# Altium project roneCPUBoard-v8.PrjPCB
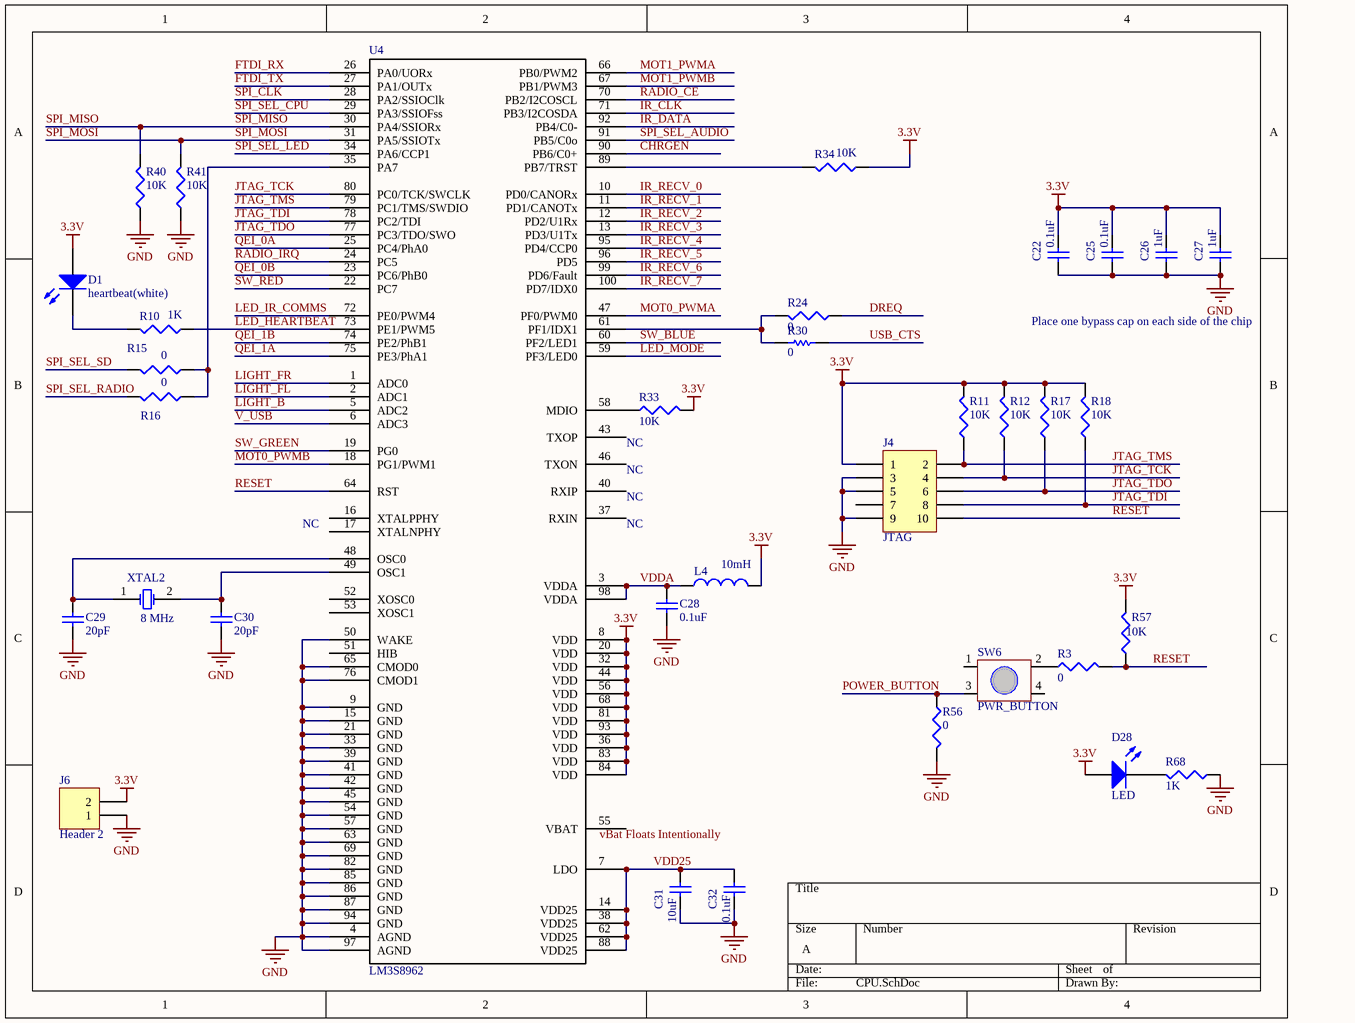
[diagram p0: CPU.SchDoc]
7 sheets, 146 parts. Net scope: global (net labels, ports and power ports of the same name join across sheets).
Board file: roneCPUBoard-v8.PcbDoc
Sheets:
  CPU.SchDoc
  USB_Headers.SchDoc
  LightSensorsButtons.SchDoc
  IRComms.SchDoc
  Radio.SchDoc
  LEDs.SchDoc
  SoundChip-ProtoHeader.SchDoc

## Sheet CPU.SchDoc
size A; PageSetup: Record=PageOptions|CenterHorizontal=True|CenterVertical=True|PrintScale=1.05|XCorrection=1.00|YCorrection=1.00|PrintKind=1|BorderSize=5000000|LeftOffset=0|BottomOffset=0|Orientation=2|PaperLength=1000|PaperWidth=1000|Scale=100|PaperSource=262|PrintQuality=600|MediaType=1|DitherType=10|PaperKind=Letter|PrintScaleMode=1

### Parts
C22  value 0.1uF  [CAPC1005L]  (hidden comment: Cap Semi)
C25  value 0.1uF  [CAPC1005L]  (hidden comment: Cap Semi)
C26  value 1uF  [CAPC1608L]  (hidden comment: Cap Semi)
C27  value 1uF  [CAPC1608L]  (hidden comment: Cap Semi)
C28  value 0.1uF  [CAPC1005L]  (hidden comment: Cap Semi)
C29  value 20pF  [CAPC1005L]  (hidden comment: Cap Semi)
C30  value 20pF  [CAPC1005L]  (hidden comment: Cap Semi)
C31  value 10uF  [CAPC1608L]  (hidden comment: Cap Semi)
C32  value 0.1uF  [CAPC1005L]  (hidden comment: Cap Semi)
D1  heartbeat(white)  [INDC2012L]
D28  LED  [SurfaceMount(603)]
J4  JTAG  [JTAG-10]
J6  Header 2  [HDR1X2]
L4  value 10mH  [INDC2012L]  (hidden comment: Inductor)
R3  value 0  [RESC1608L]  (hidden comment: Res3)
R10  value 1K  [RESC1608L]  (hidden comment: Res3)
R11  value 10K  [RESC1608L]  (hidden comment: Res3)
R12  value 10K  [RESC1608L]  (hidden comment: Res3)
R15  value 0  [RESC1608L]  (hidden comment: Res3)
R16  value 0  [RESC1608L]  (hidden comment: Res3)
R17  value 10K  [RESC1608L]  (hidden comment: Res3)
R18  value 10K  [RESC1608L]  (hidden comment: Res3)
R24  value 0  [RESC1608L]  (hidden comment: Res3)
R30  value 0  [RESC1608L]
R33  value 10K  [RESC1608L]  (hidden comment: Res3)
R34  value 10K  [RESC1608L]  (hidden comment: Res3)
R40  value 10K  [RESC1608L]  (hidden comment: Res3)
R41  value 10K  [RESC1608L]  (hidden comment: Res3)
R56  value 0  [RESC1608L]  (hidden comment: Res3)
R57  value 10K  [RESC1608L]  (hidden comment: Res3)
R68  value 1K  [RESC1608L]  (hidden comment: Res3)
SW6  PWR_BUTTON  [SwitchTall-TL330]
U4  LM3S8962  [LQFP-100]
XTAL2  8 MHz  [RESC5025L]

### Nets
3.3V: C22.2 C25.2 C26.2 C27.2 D1.1(A) D28.1(A) J4.1 J6.2 L4.2 R11.2 R12.2 R17.2 R18.2 R33.2 R34.1 R57.2 U4.8(VDD) U4.20(VDD) U4.32(VDD) U4.36(VDD) U4.44(VDD) U4.56(VDD) U4.68(VDD) U4.81(VDD) U4.83(VDD) U4.84(VDD) U4.93(VDD)
GND: C22.1 C25.1 C26.1 C27.1 C28.1 C29.1 C30.1 C31.1 C32.1 J4.3 J4.5 J4.9 J6.1 R40.1 R41.1 R56.2 R68.1 U4.4(AGND) U4.9(GND) U4.15(GND) U4.21(GND) U4.33(GND) U4.39(GND) U4.41(GND) U4.42(GND) U4.45(GND) U4.50(WAKE) U4.54(GND) U4.57(GND) U4.63(GND) U4.65(CMOD0) U4.69(GND) U4.76(CMOD1) U4.82(GND) U4.85(GND) U4.86(GND) U4.87(GND) U4.94(GND) U4.97(AGND)
V_USB: U4.6(ADC3)
CHRGEN: U4.90(PB6/C0+)
DREQ: R24.2
FTDI_RX: U4.26(PA0/UORx)
FTDI_TX: U4.27(PA1/OUTx)
IR_CLK: U4.71(PB3/I2COSDA)
IR_DATA: U4.92(PB4/C0-)
IR_RECV_0: U4.10(PD0/CANORx)
IR_RECV_1: U4.11(PD1/CANOTx)
IR_RECV_2: U4.12(PD2/U1Rx)
IR_RECV_3: U4.13(PD3/U1Tx)
IR_RECV_4: U4.95(PD4/CCP0)
IR_RECV_5: U4.96(PD5)
IR_RECV_6: U4.99(PD6/Fault)
IR_RECV_7: U4.100(PD7/IDX0)
JTAG_TCK: J4.4 R12.1 U4.80(PC0/TCK/SWCLK)
JTAG_TDI: J4.8 R18.1 U4.78(PC2/TDI)
JTAG_TDO: J4.6 R17.1 U4.77(PC3/TDO/SWO)
JTAG_TMS: J4.2 R11.1 U4.79(PC1/TMS/SWDIO)
LED_HEARTBEAT: R10.1 U4.73(PE1/PWM5)
LED_IR_COMMS: U4.72(PE0/PWM4)
LED_MODE: U4.59(PF3/LED0)
LIGHT_B: U4.5(ADC2)
LIGHT_FL: U4.2(ADC1)
LIGHT_FR: U4.1(ADC0)
MOT0_PWMA: U4.47(PF0/PWM0)
MOT0_PWMB: U4.18(PG1/PWM1)
MOT1_PWMA: U4.66(PB0/PWM2)
MOT1_PWMB: U4.67(PB1/PWM3)
POWER_BUTTON: R56.1 SW6.3
QEI_0A: U4.25(PC4/PhA0)
QEI_0B: U4.23(PC6/PhB0)
QEI_1A: U4.75(PE3/PhA1)
QEI_1B: U4.74(PE2/PhB1)
RADIO_CE: U4.70(PB2/I2COSCL)
RADIO_IRQ: U4.24(PC5)
RESET: J4.10 R3.2 R57.1 U4.64(RST)
SPI_CLK: U4.28(PA2/SSIOClk)
SPI_MISO: R40.2 U4.30(PA4/SSIORx)
SPI_MOSI: R41.2 U4.31(PA5/SSIOTx)
SPI_SEL_AUDIO: U4.91(PB5/C0o)
SPI_SEL_CPU: U4.29(PA3/SSIOFss)
SPI_SEL_LED: U4.34(PA6/CCP1)
SPI_SEL_RADIO: R16.2
SPI_SEL_SD: R15.2
SW_BLUE: U4.60(PF2/LED1)
SW_GREEN: U4.19(PG0)
SW_RED: U4.22(PC7)
USB_CTS: R30.2
VDD25: C31.2 C32.2 U4.7(LDO) U4.14(VDD25) U4.38(VDD25) U4.62(VDD25) U4.88(VDD25)
VDDA: C28.2 L4.1 U4.3(VDDA) U4.98(VDDA)
NetC29_2: C29.2 U4.48(OSC0) XTAL2.1(OSC1)
NetC30_2: C30.2 U4.49(OSC1) XTAL2.2(OSC2)
NetD1_2: D1.2(K) R10.2
NetD28_2: D28.2(K) R68.2
NetR3_1: R3.1 SW6.2
NetR15_1: R15.1 R16.1 U4.35(PA7)
NetR24_1: R24.1 R30.1 U4.61(PF1/IDX1)
NetR33_1: R33.1 U4.58(MDIO)
NetR34_2: R34.2 U4.89(PB7/TRST)

Not connected (* = marked no-connect by the designer): J4 7; SW6 1 4; U4 16(XTALPPHY) 17(XTALNPHY) 37(RXIN) 40(RXIP) 43(TXOP) 46(TXON) 51(HIB) 52(XOSC0) 53(XOSC1) 55(VBAT)

### Notes on the sheet
- Place one bypass cap on each side of the chip
- NC
- (near U4) NC
- (near U4) vBat Floats Intentionally

### Library data of the parts
C22 C25-C32 = Cap Semi: Capacitor (Semiconductor SIM Model); Published: 8-Jun-2000; LatestRevisionDate: 29-May-2009; LatestRevisionNote: IPC-7351 Footprint Added.; PackageReference: C1206; Publisher: Altium Limited; PackageDescription: Chip Capacitor
D1 = LED2: Typical RED, GREEN, YELLOW, AMBER GaAs LED; Published: 8-Jun-2000; LatestRevisionDate: 17-Jul-2002; LatestRevisionNote: Re-released for DXP Platform.; PackageVersion: Feb-2002; PackageReference: 3.2X1.6X1.1; Publisher: Altium Limited
J4 = Header 5X2H: Header, 5-Pin, Dual row, Right Angle; LatestRevisionDate: 17-Jul-2002; LatestRevisionNote: Re-released for DXP Platform.; Publisher: Altium Limited
J6 = Header 2: Header, 2-Pin; LatestRevisionDate: 17-Jul-2002; LatestRevisionNote: Re-released for DXP Platform.; Publisher: Altium Limited
L4 = Inductor: Code_IEC: 1005; Published: 8-Jun-2000; LatestRevisionDate: 29-May-2009; LatestRevisionNote: IPC-7351 Footprint Added.; PackageReference: 0402-A; Publisher: Altium Limited; PackageDescription: Chip Inductor; Code_JEITA: 0402
R3 R10-R12 R15-R18 R24 R33 R34 R40 R41 R56 R57 R68 = Res3: Resistor; Published: 8-Jun-2000; LatestRevisionDate: 29-May-2009; LatestRevisionNote: IPC-7351 Footprint Added.; PackageReference: J1-0603; Publisher: Altium Limited; PackageDescription: Chip Resistor
R30 = Res1: Resistor; Published: 8-Jun-2000; LatestRevisionDate: 17-Jul-2002; LatestRevisionNote: Re-released for DXP Platform.; PackageReference: AXIAL-0.3; Publisher: Altium Limited
SW6 = Switch-TL330
XTAL2 = XTAL: Crystal Oscillator; Published: 8-Jun-2000; LatestRevisionDate: 17-Jul-2002; LatestRevisionNote: Re-released for DXP Platform.; PackageReference: R38; Publisher: Altium Limited

## Sheet USB_Headers.SchDoc
size A
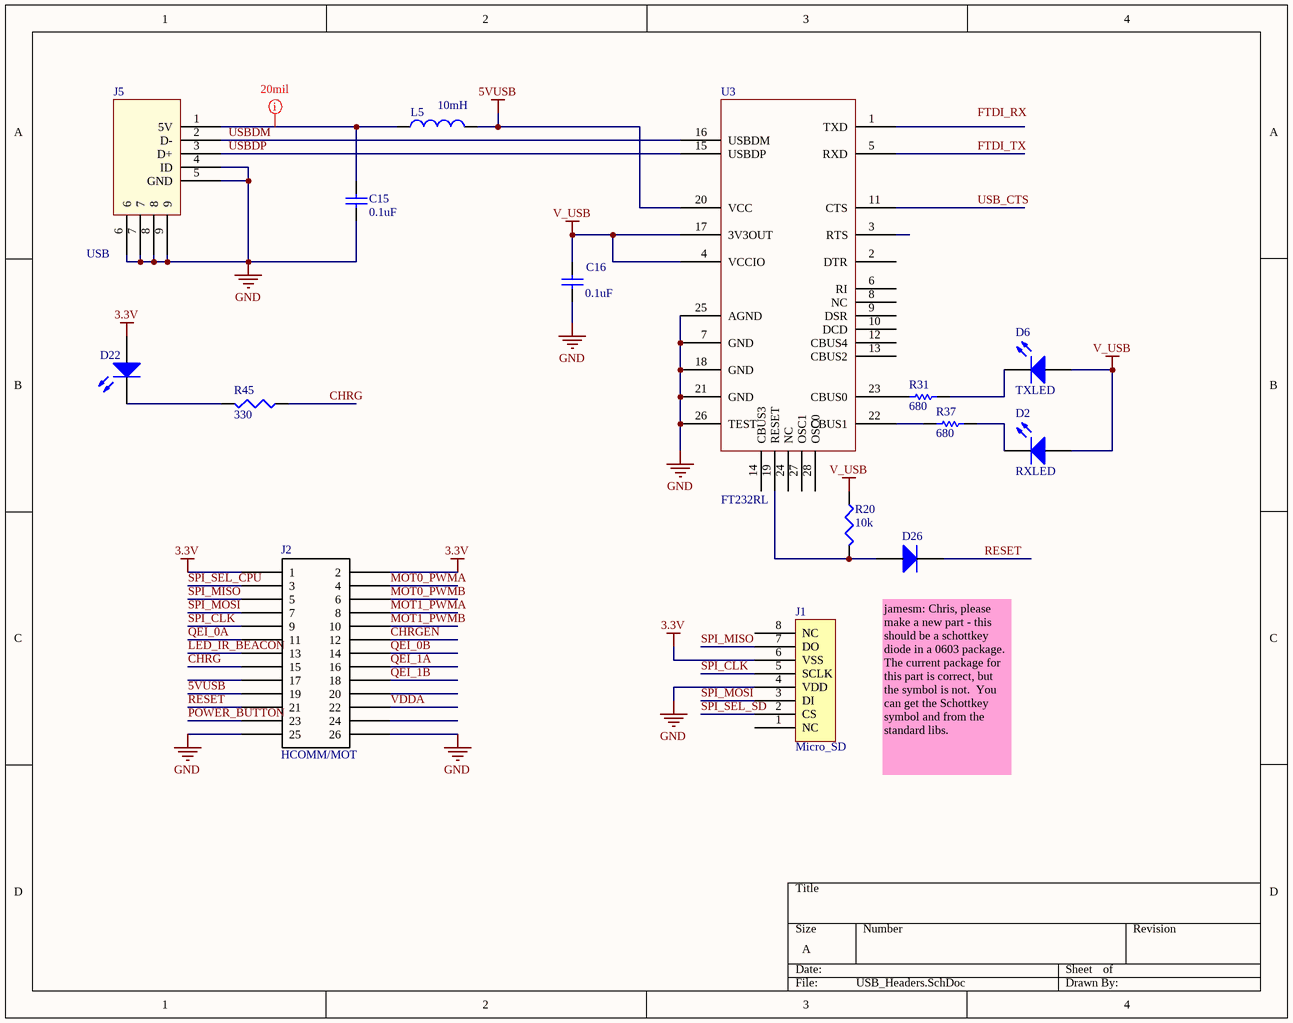
[diagram p1: USB_Headers.SchDoc]

### Parts
C15  value 0.1uF  [CAPC1005L]
C16  value 0.1uF  [CAPC1005L]
D2  RXLED  [INDC2012L]
D6  TXLED  [INDC2012L]
D22  Charge  [INDC2012L]  (value not drawn)
D26  DIODE  [SurfaceMount(603)]  (value not drawn)
J1  Micro_SD  [MICRO_SD]
J2  HCOMM/MOT  [HeaderSM 13x2]
J5  USB  [USB Minib (thru-hole)]
L5  value 10mH  [INDC2012L]  (hidden comment: Inductor)
R20  value 10k  [RESC1608L]  (hidden comment: Res3)
R31  value 680  [RESC1608L]
R37  value 680  [RESC1608L]
R45  value 330  [RESC1608L]  (hidden comment: Res3)
U3  FT232RL  [SSOP-28]

### Nets
3.3V: D22.1(A) J1.6(VSS) J2.1 J2.2
5VUSB: J2.19 L5.2 U3.20(VCC)
GND: C15.1 C16.1 J1.4(VDD) J2.25 J2.26 J5.4(ID) J5.5(GND) J5.6 J5.7 J5.8 J5.9 U3.7(GND) U3.18(GND) U3.21(GND) U3.25(AGND) U3.26(TEST)
V_USB: C16.2 D2.1(A) D6.1(A) R20.1 U3.4(VCCIO) U3.17(3V3OUT)
CHRG: J2.15 R45.1
CHRGEN: J2.12
FTDI_TX: U3.5(RXD)
LED_IR_BEACON: J2.13
MOT0_PWMA: J2.4
MOT0_PWMB: J2.6
MOT1_PWMA: J2.8
MOT1_PWMB: J2.10
POWER_BUTTON: J2.23
QEI_0A: J2.11
QEI_0B: J2.14
QEI_1A: J2.16
QEI_1B: J2.18
RESET: D26.2(K) J2.21
SPI_CLK: J1.5(SCLK) J2.9
SPI_MISO: J1.7(DO) J2.5
SPI_MOSI: J1.3(DI) J2.7
SPI_SEL_CPU: J2.3
SPI_SEL_SD: J1.2(CS)
USB_CTS: U3.11(CTS)
USBDM: J5.2(D-) U3.16(USBDM)
USBDP: J5.3(D+) U3.15(USBDP)
VDDA: J2.22
NetC15_2: C15.2 J5.1(5V) L5.1
NetD2_2: D2.2(K) R37.2
NetD6_2: D6.2(K) R31.2
NetD22_2: D22.2(K) R45.2
NetD26_1: D26.1(A) R20.2 U3.19(RESET)
NetR31_1: R31.1 U3.23(CBUS0)
NetR37_1: R37.1 U3.22(CBUS1)

Not connected (* = marked no-connect by the designer): J1 1(NC) 8(NC); J2 17 20 24; U3 1(TXD) 2(DTR) 3(RTS) 6(RI) 8(NC) 9(DSR) 10(DCD) 12(CBUS4) 13(CBUS2) 14(CBUS3) 24(NC) 27(OSC1) 28(OSC0)

### Layout directives
rule Width Constraint [Pref Width = 10mil    Min Width = 10mil    Max Width = 20mil]: NetC15_2

### Notes on the sheet
- jamesm: Chris, please make a new part - this should be a schottkey diode in a 0603 package.  The current package for this part is correct, but the symbol is not.  You can get the Schottkey symbol and from the standard libs.
- Labels drawn without touching a wire or pin: FTDI_RX

### Library data of the parts
C15 C16 = Cap: Capacitor; Published: 8-Jun-2000; LatestRevisionDate: 17-Jul-2002; LatestRevisionNote: Re-released for DXP Platform.; PackageReference: RAD-0.3; Publisher: Altium Limited
D2 D6 D22 = LED2: as D1 on sheet CPU; Published: 8-Jun-2000; LatestRevisionDate: 17-Jul-2002; LatestRevisionNote: Re-released for DXP Platform.; PackageVersion: Feb-2002; PackageReference: 3.2X1.6X1.1; Publisher: Altium Limited
J2 = HCOMM/HMOT: Header, 2X20, 50mil, IDC
J5 = USB-ConnTH
L5 = Inductor: Code_IEC: 1005; Published: 8-Jun-2000; LatestRevisionDate: 29-May-2009; LatestRevisionNote: IPC-7351 Footprint Added.; PackageReference: 0402-A; Publisher: Altium Limited; PackageDescription: Chip Inductor; Code_JEITA: 0402
R20 R45 = Res3: Resistor; Published: 8-Jun-2000; LatestRevisionDate: 29-May-2009; LatestRevisionNote: IPC-7351 Footprint Added.; PackageReference: J1-0603; Publisher: Altium Limited; PackageDescription: Chip Resistor
R31 R37 = Res1: Resistor; Published: 8-Jun-2000; LatestRevisionDate: 17-Jul-2002; LatestRevisionNote: Re-released for DXP Platform.; PackageReference: AXIAL-0.3; Publisher: Altium Limited

## Sheet LightSensorsButtons.SchDoc
size A
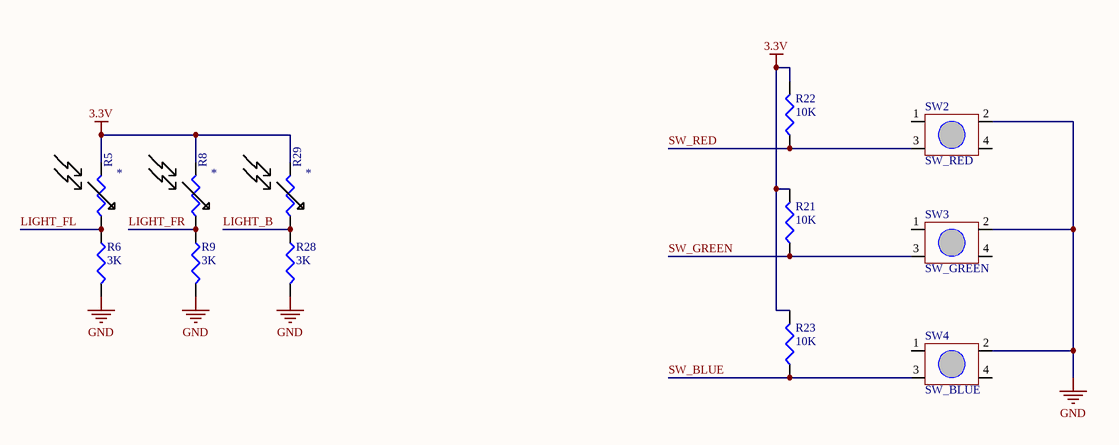
[diagram p2: LightSensorsButtons.SchDoc]

### Parts
R5  photoresistor  [photoresistor]  (value not drawn)
R6  value 3K  [RESC1608L]  (hidden comment: Res3)
R8  photoresistor  [photoresistor]  (value not drawn)
R9  value 3K  [RESC1608L]  (hidden comment: Res3)
R21  value 10K  [RESC1608L]  (hidden comment: Res3)
R22  value 10K  [RESC1608L]  (hidden comment: Res3)
R23  value 10K  [RESC1608L]  (hidden comment: Res3)
R28  value 3K  [RESC1608L]  (hidden comment: Res3)
R29  photoresistor  [photoresistor]  (value not drawn)
SW2  SW_RED  [SwitchTall-TL330]
SW3  SW_GREEN  [SwitchTall-TL330]
SW4  SW_BLUE  [SwitchTall-TL330]

### Nets
3.3V: R5.2 R8.2 R21.2 R22.2 R23.2 R29.2
GND: R6.2 R9.2 R28.2 SW2.2 SW3.2 SW4.2
LIGHT_B: R28.1 R29.1
LIGHT_FL: R5.1 R6.1
LIGHT_FR: R8.1 R9.1
SW_BLUE: R23.1 SW4.3
SW_GREEN: R21.1 SW3.3
SW_RED: R22.1 SW2.3

Not connected (* = marked no-connect by the designer): SW2 1 4; SW3 1 4; SW4 1 4

### Library data of the parts
R6 R9 R21-R23 R28 = Res3: Resistor; Published: 8-Jun-2000; LatestRevisionDate: 29-May-2009; LatestRevisionNote: IPC-7351 Footprint Added.; PackageReference: J1-0603; Publisher: Altium Limited; PackageDescription: Chip Resistor
SW2-SW4 = Switch-TL330
R5 R8 R29 = photoresistor: Value: *

## Sheet IRComms.SchDoc
size A
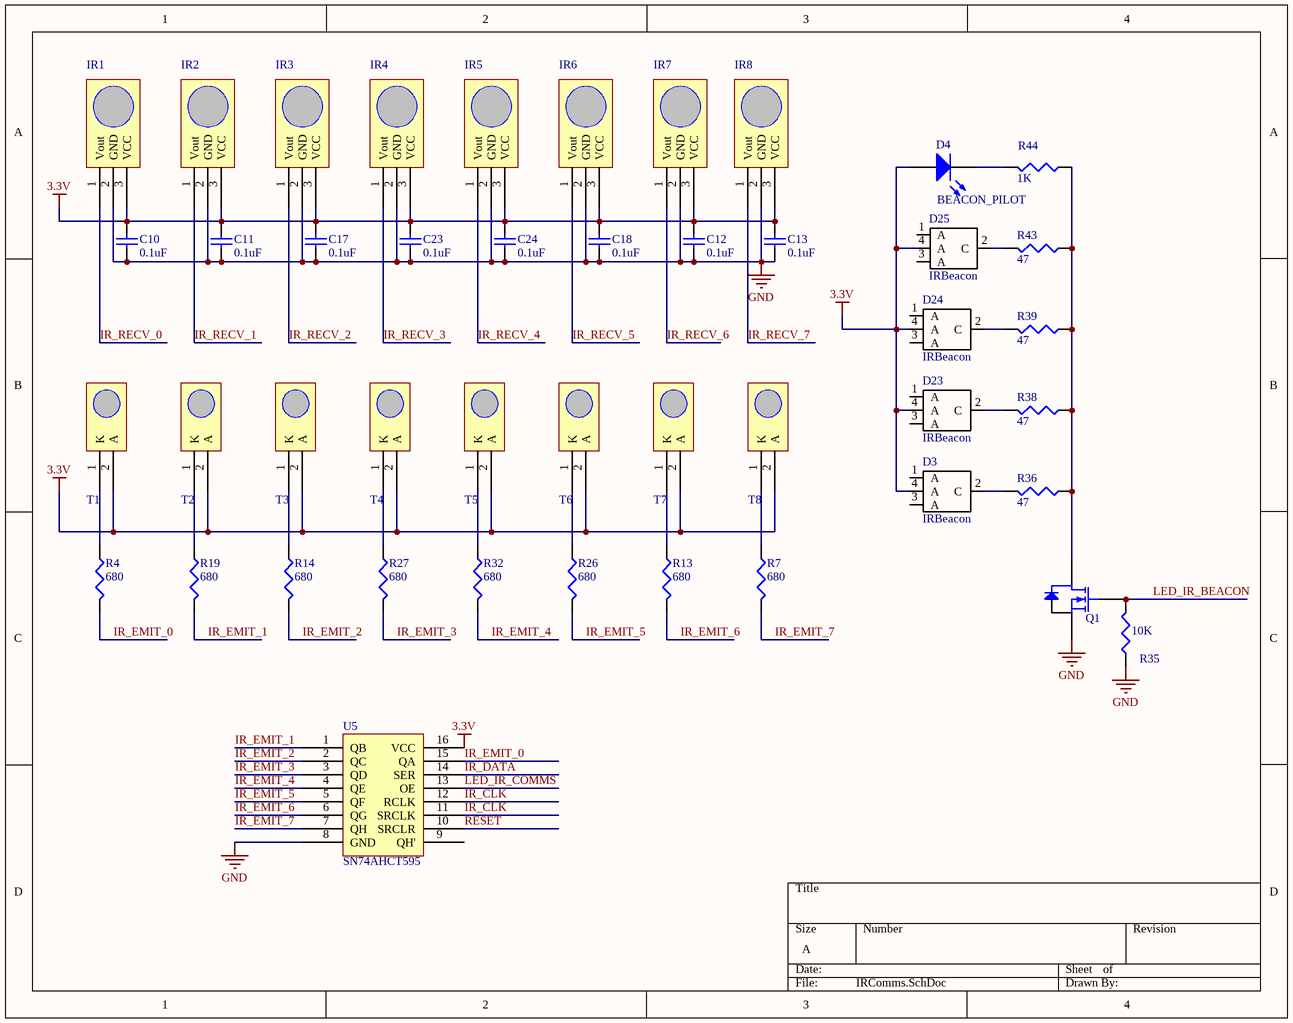
[diagram p3: IRComms.SchDoc]

### Parts
C10  value 0.1uF  [CAPC1005L]  (hidden comment: Cap Semi)
C11  value 0.1uF  [CAPC1005L]  (hidden comment: Cap Semi)
C12  value 0.1uF  [CAPC1005L]  (hidden comment: Cap Semi)
C13  value 0.1uF  [CAPC1005L]  (hidden comment: Cap Semi)
C17  value 0.1uF  [CAPC1005L]  (hidden comment: Cap Semi)
C18  value 0.1uF  [CAPC1005L]  (hidden comment: Cap Semi)
C23  value 0.1uF  [CAPC1005L]  (hidden comment: Cap Semi)
C24  value 0.1uF  [CAPC1005L]  (hidden comment: Cap Semi)
D3  IRBeacon  [IRBeacon]
D4  BEACON_PILOT  [SurfaceMount(603)]
D23  IRBeacon  [IRBeacon]
D24  IRBeacon  [IRBeacon]
D25  IRBeacon  [IRBeacon]
IR1  GP1UX31QS  [GP1UX31QS]  (value not drawn)
IR2  GP1UX31QS  [GP1UX31QS]  (value not drawn)
IR3  GP1UX31QS  [GP1UX31QS]  (value not drawn)
IR4  GP1UX31QS  [GP1UX31QS]  (value not drawn)
IR5  GP1UX31QS  [GP1UX31QS]  (value not drawn)
IR6  GP1UX31QS  [GP1UX31QS]  (value not drawn)
IR7  GP1UX31QS  [GP1UX31QS]  (value not drawn)
IR8  GP1UX31QS  [GP1UX31QS]  (value not drawn)
Q1  Mosfet  [SOT-23]  (value not drawn)
R4  value 680  [RESC1608L]  (hidden comment: Res3)
R7  value 680  [RESC1608L]  (hidden comment: Res3)
R13  value 680  [RESC1608L]  (hidden comment: Res3)
R14  value 680  [RESC1608L]  (hidden comment: Res3)
R19  value 680  [RESC1608L]  (hidden comment: Res3)
R26  value 680  [RESC1608L]  (hidden comment: Res3)
R27  value 680  [RESC1608L]  (hidden comment: Res3)
R32  value 680  [RESC1608L]  (hidden comment: Res3)
R35  value 10K  [RESC1608L]  (hidden comment: Res3)
R36  value 47  [RESC1608L]  (hidden comment: Res3)
R38  value 47  [RESC1608L]  (hidden comment: Res3)
R39  value 47  [RESC1608L]  (hidden comment: Res3)
R43  value 47  [RESC1608L]  (hidden comment: Res3)
R44  value 1K  [RESC1608L]  (hidden comment: Res3)
T1  LN54  [LN54]  (value not drawn)
T2  LN54  [LN54]  (value not drawn)
T3  LN54  [LN54]  (value not drawn)
T4  LN54  [LN54]  (value not drawn)
T5  LN54  [LN54]  (value not drawn)
T6  LN54  [LN54]  (value not drawn)
T7  LN54  [LN54]  (value not drawn)
T8  LN54  [LN54]  (value not drawn)
U5  SN74AHCT595  [TSOP65P640X120-16N]

### Nets
3.3V: C10.2 C11.2 C12.2 C13.2 C17.2 C18.2 C23.2 C24.2 D3.4(A) D4.1(A) D23.4(A) D24.4(A) D25.4(A) IR1.3(VCC) IR2.3(VCC) IR3.3(VCC) IR4.3(VCC) IR5.3(VCC) IR6.3(VCC) IR7.3(VCC) IR8.3(VCC) T1.2(A) T2.2(A) T3.2(A) T4.2(A) T5.2(A) T6.2(A) T7.2(A) T8.2(A) U5.16(VCC)
GND: C10.1 C11.1 C12.1 C13.1 C17.1 C18.1 C23.1 C24.1 IR1.2(GND) IR2.2(GND) IR3.2(GND) IR4.2(GND) IR5.2(GND) IR6.2(GND) IR7.2(GND) IR8.2(GND) Q1.2(S) R35.1 U5.8(GND)
IR_CLK: U5.11(SRCLK) U5.12(RCLK)
IR_DATA: U5.14(SER)
IR_EMIT_0: R4.2 U5.15(QA)
IR_EMIT_1: R19.2 U5.1(QB)
IR_EMIT_2: R14.2 U5.2(QC)
IR_EMIT_3: R27.2 U5.3(QD)
IR_EMIT_4: R32.2 U5.4(QE)
IR_EMIT_5: R26.2 U5.5(QF)
IR_EMIT_6: R13.2 U5.6(QG)
IR_EMIT_7: R7.2 U5.7(QH)
IR_RECV_0: IR1.1(Vout)
IR_RECV_1: IR2.1(Vout)
IR_RECV_2: IR3.1(Vout)
IR_RECV_3: IR4.1(Vout)
IR_RECV_4: IR5.1(Vout)
IR_RECV_5: IR6.1(Vout)
IR_RECV_6: IR7.1(Vout)
IR_RECV_7: IR8.1(Vout)
LED_IR_BEACON: Q1.1(G) R35.2
LED_IR_COMMS: U5.13(OE)
RESET: U5.10(SRCLR)
NetD3_2: D3.2(C) R36.2
NetD4_2: D4.2(K) R44.2
NetD23_2: D23.2(C) R38.2
NetD24_2: D24.2(C) R39.2
NetD25_2: D25.2(C) R43.2
NetQ1_3: Q1.3(D) R36.1 R38.1 R39.1 R43.1 R44.1
NetR4_1: R4.1 T1.1(K)
NetR7_1: R7.1 T8.1(K)
NetR13_1: R13.1 T7.1(K)
NetR14_1: R14.1 T3.1(K)
NetR19_1: R19.1 T2.1(K)
NetR26_1: R26.1 T6.1(K)
NetR27_1: R27.1 T4.1(K)
NetR32_1: R32.1 T5.1(K)

Not connected (* = marked no-connect by the designer): D3 1(A) 3(A); D23 1(A) 3(A); D24 1(A) 3(A); D25 1(A) 3(A); U5 9(QH')

### Library data of the parts
C10-C13 C17 C18 C23 C24 = Cap Semi: Capacitor (Semiconductor SIM Model); Published: 8-Jun-2000; LatestRevisionDate: 29-May-2009; LatestRevisionNote: IPC-7351 Footprint Added.; PackageReference: C1206; Publisher: Altium Limited; PackageDescription: Chip Capacitor
D4 = LED
R4 R7 R13 R14 R19 R26 R27 R32 R35 R36 R38 R39 R43 R44 = Res3: Resistor; Published: 8-Jun-2000; LatestRevisionDate: 29-May-2009; LatestRevisionNote: IPC-7351 Footprint Added.; PackageReference: J1-0603; Publisher: Altium Limited; PackageDescription: Chip Resistor
U5 = SN74AHCT595_Shift_Register

## Sheet Radio.SchDoc
size A
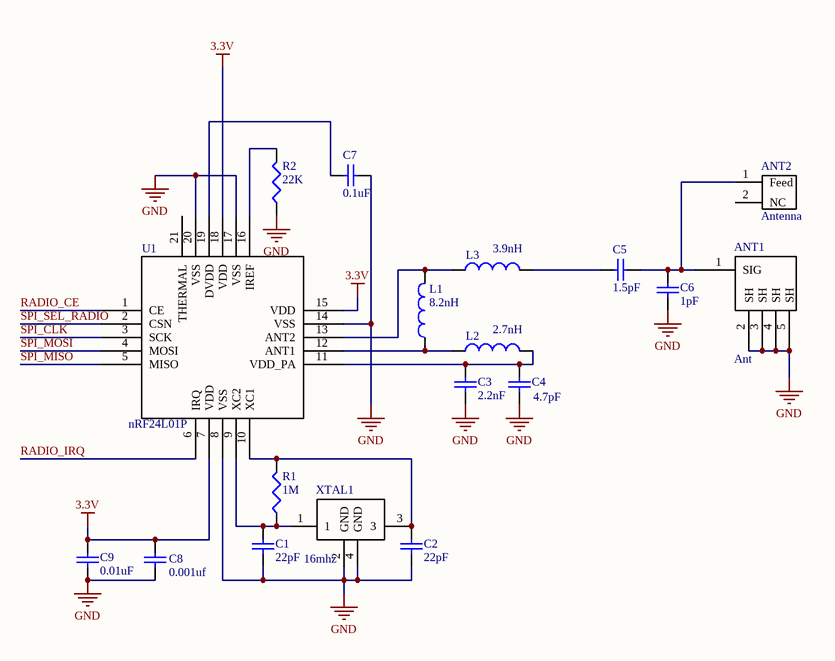
[diagram p4: Radio.SchDoc]

### Parts
ANT1  Ant  [AntennaSMA]
ANT2  Antenna  [antenna]
C1  value 22pF  [CAPC1005L]  (hidden comment: Cap Semi)
C2  value 22pF  [CAPC1005L]  (hidden comment: Cap Semi)
C3  value 2.2nF  [CAPC1005L]  (hidden comment: Cap Semi)
C4  value 4.7pF  [CAPC1005L]  (hidden comment: Cap Semi)
C5  value 1.5pF  [CAPC1005L]  (hidden comment: Cap Semi)
C6  value 1pF  [CAPC1005L]  (hidden comment: Cap Semi)
C7  value 0.1uF  [CAPC1005L]  (hidden comment: Cap Semi)
C8  value 0.001uf  [CAPC1005L]  (hidden comment: Cap Semi)
C9  value 0.01uF  [CAPC1005L]  (hidden comment: Cap Semi)
L1  value 8.2nH  [INDC1005AL]  (hidden comment: Inductor)
L2  value 2.7nH  [INDC1005AL]  (hidden comment: Inductor)
L3  value 3.9nH  [INDC1005AL]  (hidden comment: Inductor)
R1  value 1M  [RESC1608L]  (hidden comment: Res3)
R2  value 22K  [RESC1608L]  (hidden comment: Res3)
U1  nRF24L01P  [QFN-20]
XTAL1  value 16mhz  [RadioCrystal]  (hidden comment: RADIO CRYSTAL)

### Nets
3.3V: C8.2 C9.2 U1.7(VDD) U1.15(VDD) U1.18(VDD)
GND: ANT1.2(SH) ANT1.3(SH) ANT1.4(SH) ANT1.5(SH) C1.1 C2.1 C3.1 C4.1 C6.1 C7.1 C8.1 C9.1 R2.1 U1.8(VSS) U1.14(VSS) U1.17(VSS) U1.20(VSS) XTAL1.2(GND) XTAL1.4(GND)
RADIO_CE: U1.1(CE)
RADIO_IRQ: U1.6(IRQ)
SPI_CLK: U1.3(SCK)
SPI_MISO: U1.5(MISO)
SPI_MOSI: U1.4(MOSI)
SPI_SEL_RADIO: U1.2(CSN)
NetANT1_1: ANT1.1(SIG) ANT2.1(Feed) C5.1 C6.2
NetC1_2: C1.2 R1.1 U1.9(XC2) XTAL1.1
NetC2_2: C2.2 R1.2 U1.10(XC1) XTAL1.3
NetC3_2: C3.2 C4.2 L2.2 U1.11(VDD_PA)
NetC5_2: C5.2 L3.2
NetC7_2: C7.2 U1.19(DVDD)
NetL1_1: L1.1 L2.1 U1.12(ANT1)
NetL1_2: L1.2 L3.1 U1.13(ANT2)
NetR2_2: R2.2 U1.16(IREF)

Not connected (* = marked no-connect by the designer): ANT2 2(NC); U1 21(THERMAL)

### Library data of the parts
ANT1 = AntennaConn
C1-C9 = Cap Semi: Capacitor (Semiconductor SIM Model); Published: 8-Jun-2000; LatestRevisionDate: 29-May-2009; LatestRevisionNote: IPC-7351 Footprint Added.; PackageReference: C1206; Publisher: Altium Limited; PackageDescription: Chip Capacitor
L1-L3 = Inductor: Code_IEC: 1005; Published: 8-Jun-2000; LatestRevisionDate: 29-May-2009; LatestRevisionNote: IPC-7351 Footprint Added.; PackageReference: 0402-A; Publisher: Altium Limited; PackageDescription: Chip Inductor; Code_JEITA: 0402
R1 R2 = Res3: Resistor; Published: 8-Jun-2000; LatestRevisionDate: 29-May-2009; LatestRevisionNote: IPC-7351 Footprint Added.; PackageReference: J1-0603; Publisher: Altium Limited; PackageDescription: Chip Resistor
U1 = radio-nRF24L01P
XTAL1 = RadioCrystal

## Sheet LEDs.SchDoc
size A
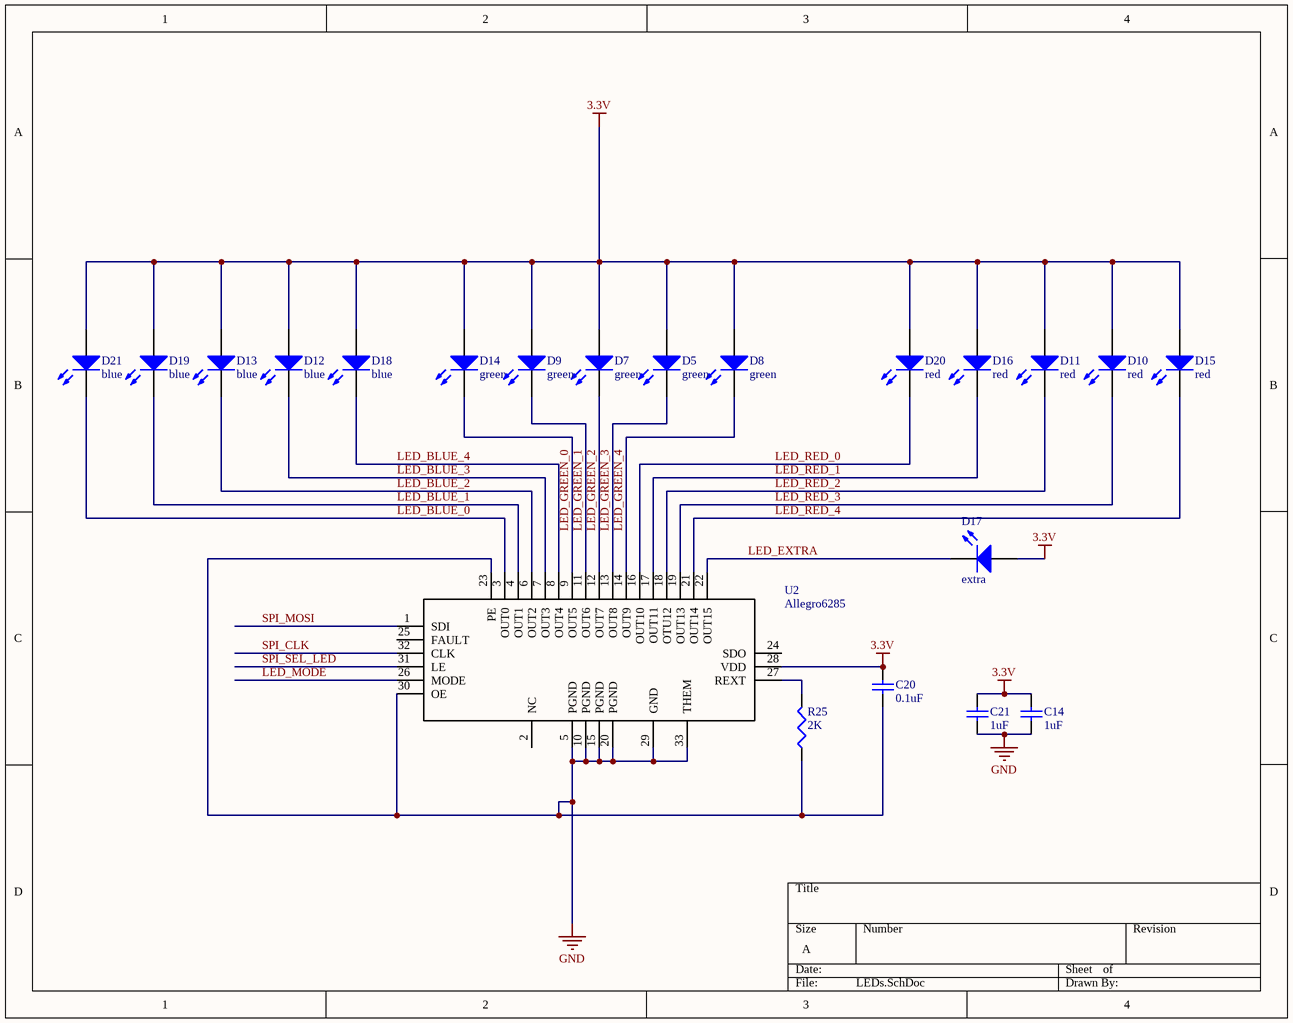
[diagram p5: LEDs.SchDoc]

### Parts
C14  value 1uF  [CAPC1608L]  (hidden comment: Cap Semi)
C20  value 0.1uF  [CAPC1005L]  (hidden comment: Cap Semi)
C21  value 1uF  [CAPC1608L]  (hidden comment: Cap Semi)
D5  green  [SurfaceMount(603)]
D7  green  [SurfaceMount(603)]
D8  green  [SurfaceMount(603)]
D9  green  [SurfaceMount(603)]
D10  red  [SurfaceMount(603)]
D11  red  [SurfaceMount(603)]
D12  blue  [SurfaceMount(603)]
D13  blue  [SurfaceMount(603)]
D14  green  [SurfaceMount(603)]
D15  red  [SurfaceMount(603)]
D16  red  [SurfaceMount(603)]
D17  extra  [SurfaceMount(603)]
D18  blue  [SurfaceMount(603)]
D19  blue  [SurfaceMount(603)]
D20  red  [SurfaceMount(603)]
D21  blue  [SurfaceMount(603)]
R25  value 2K  [RESC1608L]  (hidden comment: Res3)
U2  Allegro6285  [QFN-32]

### Nets
3.3V: C14.2 C20.2 C21.2 D5.1(A) D7.1(A) D8.1(A) D9.1(A) D10.1(A) D11.1(A) D12.1(A) D13.1(A) D14.1(A) D15.1(A) D16.1(A) D17.1(A) D18.1(A) D19.1(A) D20.1(A) D21.1(A) U2.28(VDD)
GND: C14.1 C20.1 C21.1 R25.1 U2.5(PGND) U2.10(PGND) U2.15(PGND) U2.20(PGND) U2.23(PE) U2.29(GND) U2.30(OE) U2.33(THEM)
LED_BLUE_0: D21.2(K) U2.3(OUT0)
LED_BLUE_1: D19.2(K) U2.4(OUT1)
LED_BLUE_2: D13.2(K) U2.6(OUT2)
LED_BLUE_3: D12.2(K) U2.7(OUT3)
LED_BLUE_4: D18.2(K) U2.8(OUT4)
LED_EXTRA: D17.2(K) U2.22(OUT15)
LED_GREEN_0: D14.2(K) U2.9(OUT5)
LED_GREEN_1: D9.2(K) U2.11(OUT6)
LED_GREEN_2: D7.2(K) U2.12(OUT7)
LED_GREEN_3: D5.2(K) U2.13(OUT8)
LED_GREEN_4: D8.2(K) U2.14(OUT9)
LED_MODE: U2.26(MODE)
LED_RED_0: D20.2(K) U2.16(OUT10)
LED_RED_1: D16.2(K) U2.17(OUT11)
LED_RED_2: D11.2(K) U2.18(OTU12)
LED_RED_3: D10.2(K) U2.19(OUT13)
LED_RED_4: D15.2(K) U2.21(OUT14)
SPI_CLK: U2.32(CLK)
SPI_MOSI: U2.1(SDI)
SPI_SEL_LED: U2.31(LE)
NetR25_2: R25.2 U2.27(REXT)

Not connected (* = marked no-connect by the designer): U2 2(NC) 24(SDO) 25(FAULT)

### Library data of the parts
C14 C20 C21 = Cap Semi: Capacitor (Semiconductor SIM Model); Published: 8-Jun-2000; LatestRevisionDate: 29-May-2009; LatestRevisionNote: IPC-7351 Footprint Added.; PackageReference: C1206; Publisher: Altium Limited; PackageDescription: Chip Capacitor
D5 D7-D21 = LED
R25 = Res3: Resistor; Published: 8-Jun-2000; LatestRevisionDate: 29-May-2009; LatestRevisionNote: IPC-7351 Footprint Added.; PackageReference: J1-0603; Publisher: Altium Limited; PackageDescription: Chip Resistor

## Sheet SoundChip-ProtoHeader.SchDoc
size A
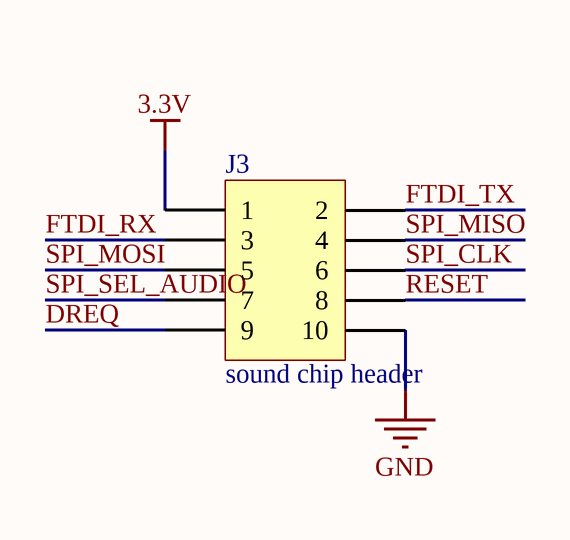
[diagram p6: SoundChip-ProtoHeader.SchDoc]

### Parts
J3  sound chip header  [HDR2X5]

### Nets
3.3V: J3.1
GND: J3.10
DREQ: J3.9
FTDI_RX: J3.3
FTDI_TX: J3.2
RESET: J3.8
SPI_CLK: J3.6
SPI_MISO: J3.4
SPI_MOSI: J3.5
SPI_SEL_AUDIO: J3.7

### Library data of the parts
J3 = Header 5X2: Header, 5-Pin, Dual row; LatestRevisionDate: 17-Jul-2002; LatestRevisionNote: Re-released for DXP Platform.; Publisher: Altium Limited

## Nets that join several sheets
3.3V: CPU (27 pins), USB_Headers (D22.1 J1.6 J2.1 J2.2), LightSensorsButtons (6 pins), IRComms (30 pins), Radio (5 pins), LEDs (20 pins), SoundChip-ProtoHeader (J3.1)
GND: CPU (39 pins), USB_Headers (16 pins), LightSensorsButtons (6 pins), IRComms (19 pins), Radio (19 pins), LEDs (12 pins), SoundChip-ProtoHeader (J3.10)
V_USB: CPU (U4.6), USB_Headers (6 pins)
CHRGEN: CPU (U4.90), USB_Headers (J2.12)
DREQ: CPU (R24.2), SoundChip-ProtoHeader (J3.9)
FTDI_RX: CPU (U4.26), SoundChip-ProtoHeader (J3.3)
FTDI_TX: CPU (U4.27), USB_Headers (U3.5), SoundChip-ProtoHeader (J3.2)
IR_CLK: CPU (U4.71), IRComms (U5.11 U5.12)
IR_DATA: CPU (U4.92), IRComms (U5.14)
IR_RECV_0: CPU (U4.10), IRComms (IR1.1)
IR_RECV_1: CPU (U4.11), IRComms (IR2.1)
IR_RECV_2: CPU (U4.12), IRComms (IR3.1)
IR_RECV_3: CPU (U4.13), IRComms (IR4.1)
IR_RECV_4: CPU (U4.95), IRComms (IR5.1)
IR_RECV_5: CPU (U4.96), IRComms (IR6.1)
IR_RECV_6: CPU (U4.99), IRComms (IR7.1)
IR_RECV_7: CPU (U4.100), IRComms (IR8.1)
LED_IR_BEACON: USB_Headers (J2.13), IRComms (Q1.1 R35.2)
LED_IR_COMMS: CPU (U4.72), IRComms (U5.13)
LED_MODE: CPU (U4.59), LEDs (U2.26)
LIGHT_B: CPU (U4.5), LightSensorsButtons (R28.1 R29.1)
LIGHT_FL: CPU (U4.2), LightSensorsButtons (R5.1 R6.1)
LIGHT_FR: CPU (U4.1), LightSensorsButtons (R8.1 R9.1)
MOT0_PWMA: CPU (U4.47), USB_Headers (J2.4)
MOT0_PWMB: CPU (U4.18), USB_Headers (J2.6)
MOT1_PWMA: CPU (U4.66), USB_Headers (J2.8)
MOT1_PWMB: CPU (U4.67), USB_Headers (J2.10)
POWER_BUTTON: CPU (R56.1 SW6.3), USB_Headers (J2.23)
QEI_0A: CPU (U4.25), USB_Headers (J2.11)
QEI_0B: CPU (U4.23), USB_Headers (J2.14)
QEI_1A: CPU (U4.75), USB_Headers (J2.16)
QEI_1B: CPU (U4.74), USB_Headers (J2.18)
RADIO_CE: CPU (U4.70), Radio (U1.1)
RADIO_IRQ: CPU (U4.24), Radio (U1.6)
RESET: CPU (J4.10 R3.2 R57.1 U4.64), USB_Headers (D26.2 J2.21), IRComms (U5.10), SoundChip-ProtoHeader (J3.8)
SPI_CLK: CPU (U4.28), USB_Headers (J1.5 J2.9), Radio (U1.3), LEDs (U2.32), SoundChip-ProtoHeader (J3.6)
SPI_MISO: CPU (R40.2 U4.30), USB_Headers (J1.7 J2.5), Radio (U1.5), SoundChip-ProtoHeader (J3.4)
SPI_MOSI: CPU (R41.2 U4.31), USB_Headers (J1.3 J2.7), Radio (U1.4), LEDs (U2.1), SoundChip-ProtoHeader (J3.5)
SPI_SEL_AUDIO: CPU (U4.91), SoundChip-ProtoHeader (J3.7)
SPI_SEL_CPU: CPU (U4.29), USB_Headers (J2.3)
SPI_SEL_LED: CPU (U4.34), LEDs (U2.31)
SPI_SEL_RADIO: CPU (R16.2), Radio (U1.2)
SPI_SEL_SD: CPU (R15.2), USB_Headers (J1.2)
SW_BLUE: CPU (U4.60), LightSensorsButtons (R23.1 SW4.3)
SW_GREEN: CPU (U4.19), LightSensorsButtons (R21.1 SW3.3)
SW_RED: CPU (U4.22), LightSensorsButtons (R22.1 SW2.3)
USB_CTS: CPU (R30.2), USB_Headers (U3.11)
VDDA: CPU (C28.2 L4.1 U4.3 U4.98), USB_Headers (J2.22)